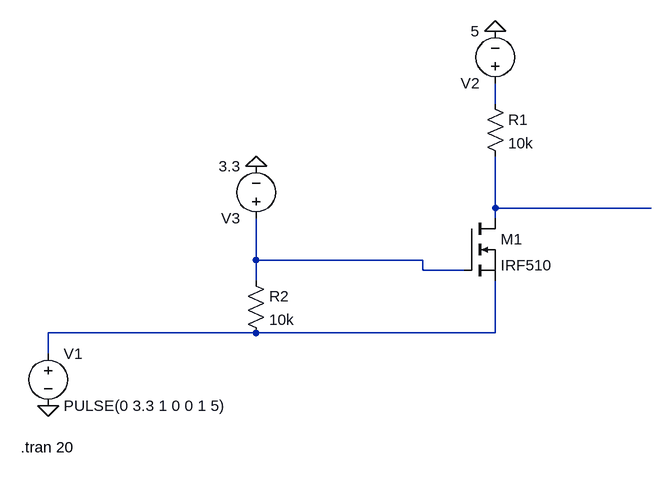
[diagram p0: schematic LevelShifter.asc]
LevelShifter.asc, the LTspice schematic file:
Version 4
SHEET 1 1028 680
WIRE 432 -96 432 -128
WIRE 432 64 432 -16
WIRE 672 64 432 64
WIRE 432 80 432 64
WIRE 64 144 64 80
WIRE 320 144 64 144
WIRE 320 160 320 144
WIRE 384 160 320 160
WIRE 64 176 64 144
WIRE 64 256 -256 256
WIRE 432 256 432 176
WIRE 432 256 64 256
WIRE -256 288 -256 256
FLAG -256 368 0
FLAG 432 -208 0
FLAG 64 0 0
SYMBOL voltage -256 272 R0
WINDOW 123 0 0 Left 0
WINDOW 39 0 0 Left 0
SYMATTR InstName V1
SYMATTR Value PULSE(0 3.3 1 0 0 1 5)
SYMBOL voltage 432 -112 R180
WINDOW 123 0 0 Left 0
WINDOW 39 0 0 Left 0
SYMATTR InstName V2
SYMATTR Value 5
SYMBOL res 416 -112 R0
SYMATTR InstName R1
SYMATTR Value 10k
SYMBOL res 48 160 R0
SYMATTR InstName R2
SYMATTR Value 10k
SYMBOL nmos 384 80 R0
SYMATTR InstName M1
SYMATTR Value IRF510
SYMBOL voltage 64 96 R180
WINDOW 123 0 0 Left 0
WINDOW 39 0 0 Left 0
SYMATTR InstName V3
SYMATTR Value 3.3
TEXT -298 432 Left 2 !.tran 20

The netlist it stands for:
* LevelShifter.asc
V1 N004 0 PULSE(0 3.3 1 0 0 1 5)
V2 N001 0 5
R1 N001 N002 10k
R2 N003 N004 10k
M1 N002 N003 N004 N004 IRF510
V3 N003 0 3.3
.model NMOS NMOS
.model PMOS PMOS
.lib standard.mos
.tran 20
.backanno
.end